# EAGLE design rapidshark-main-breakout-top-mk-1.1 (EAGLE 6.5.0)
AUTHOR: sean@yak.net
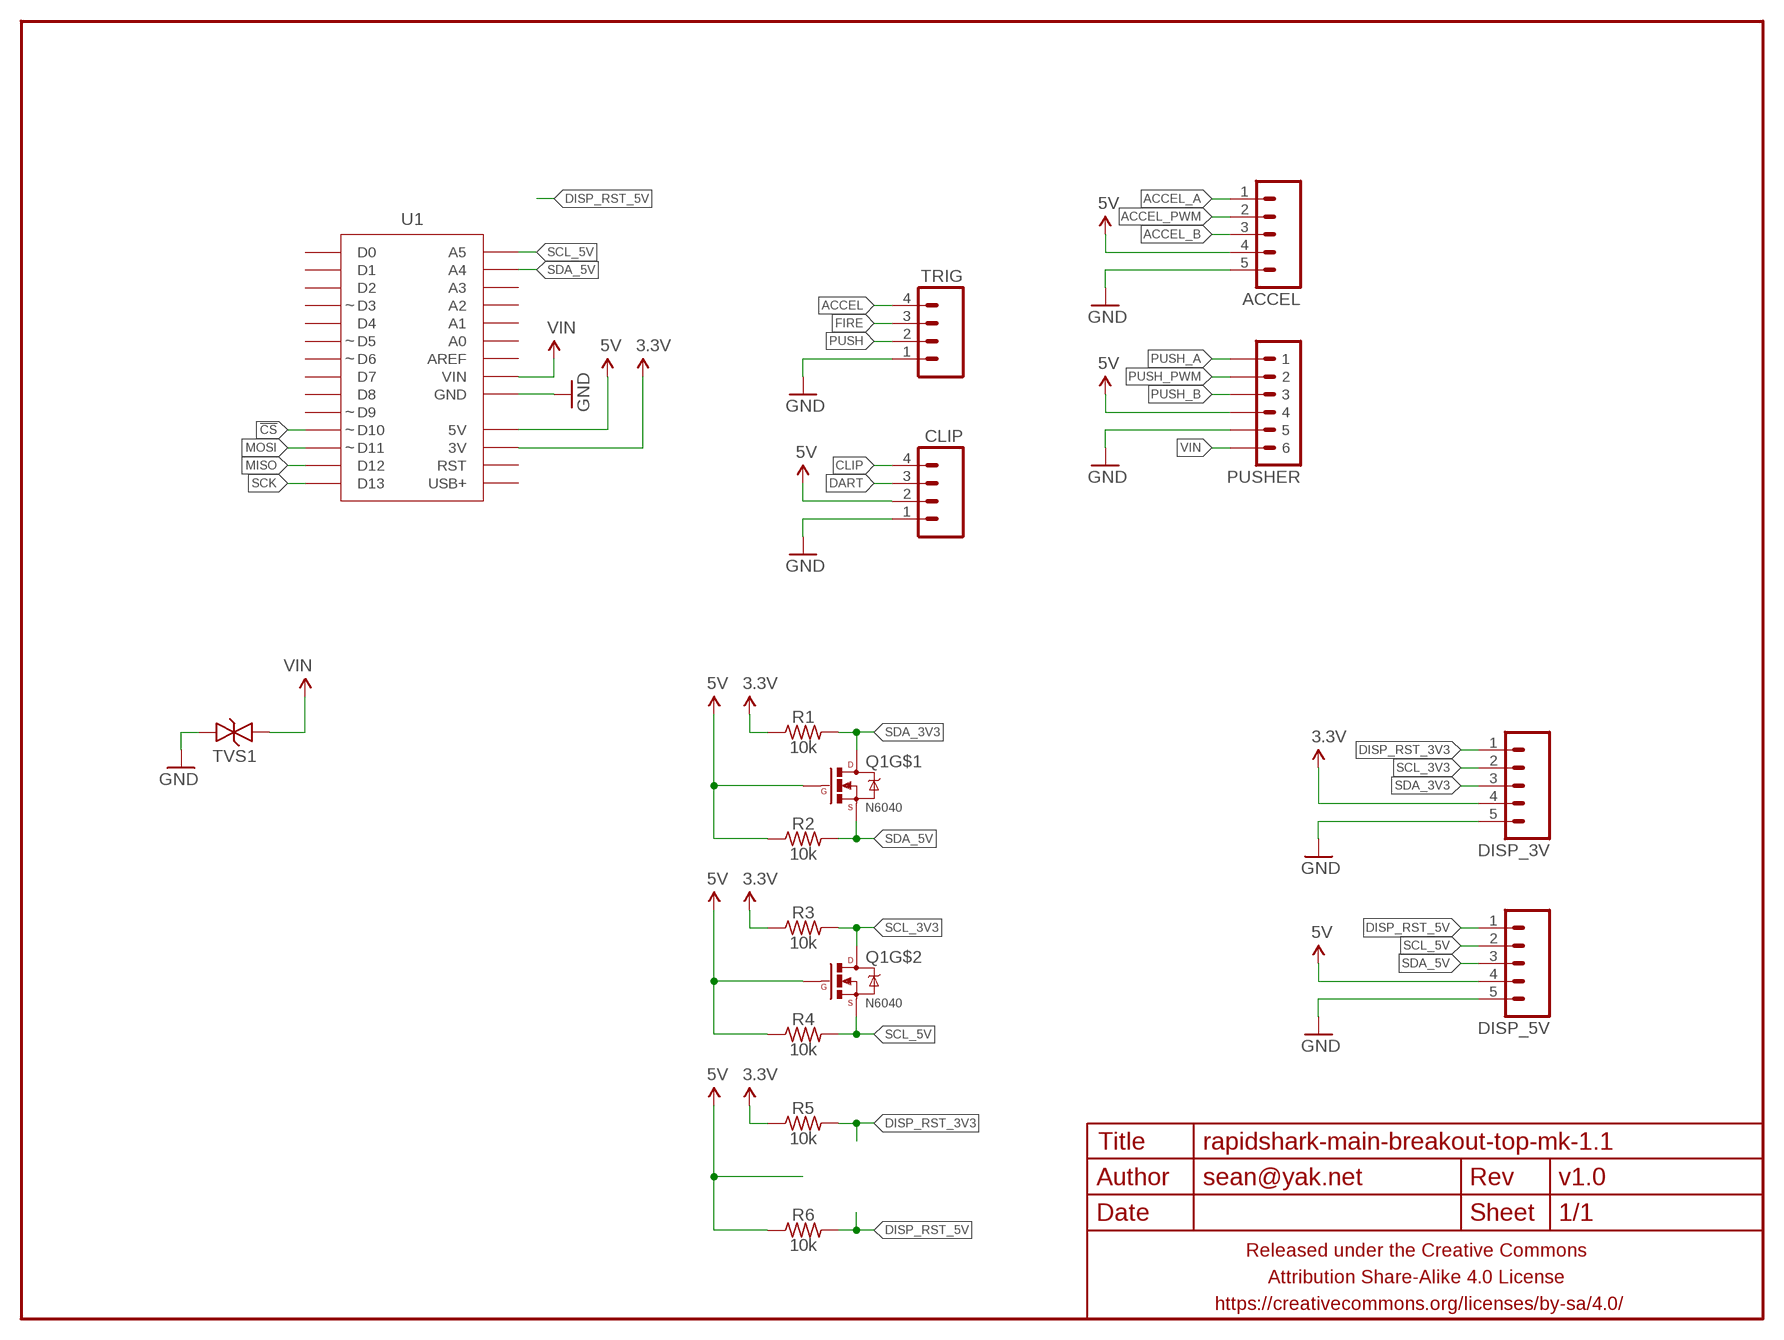
[diagram p0: schematic, sheet 1]

## Parts
ACCEL  M05JST-PH-VERT-PTH  [JST-5-PH-VERT-PTH]
CLIP  M04JST-PTH-VERT  [JST-4-PH-VERT-PTH]
DISP_3V  M05JST-PH-VERT-PTH  [JST-5-PH-VERT-PTH]
DISP_5V  M05JST-PH-VERT-PTH  [JST-5-PH-VERT-PTH]
FRAME1  FRAME-LETTERNO_PACKAGE  [DUMMY]
PUSHER  M06JST-PH-PTH-VERT  [JST-6-PH-VERT-PTH]
Q1  N6040  MOSFET-NCHANNEL-DUALSOIC8  [SO08]
R1  10k  RESISTORR0603  [R0603]
R2  10k  RESISTORR0603  [R0603]
R3  10k  RESISTORR0603  [R0603]
R4  10k  RESISTORR0603  [R0603]
R5  10k  RESISTORR0603  [R0603]
R6  10k  RESISTORR0603  [R0603]
TRIG  M04JST-PTH-VERT  [JST-4-PH-VERT-PTH]
TVS1  TVSSMA  [SMA-DIODE-TVS-BIDIR]
U1  ADAFRUIT_METRO_MININOSILK-ABMBI  [ADAFRUIT_METRO_MINI_FLIPPED]

## Nets
3.3V: DISP_3V.4 R1.1 R3.1 R5.1 U1.17(3V)
5V: ACCEL.4 CLIP.2 DISP_5V.4 Q1.2(G) Q1.4(G) R2.1 R4.1 R6.1 U1.18(5V)
!CS: U1.11(D10)
ACCEL: TRIG.4
ACCEL_A: ACCEL.1
ACCEL_B: ACCEL.3
ACCEL_PWM: ACCEL.2
CLIP: CLIP.4
DART: CLIP.3
DISP_RST_3V3: DISP_3V.1 R5.2
DISP_RST_5V: DISP_5V.1 R6.2
FIRE: TRIG.3
GND: ACCEL.5 CLIP.1 DISP_3V.5 DISP_5V.5 TRIG.1 TVS1.1 U1.19(GND) U1.20(GND)
MISO: U1.13(D12)
MOSI: U1.12(D11)
PUSH: TRIG.2
PUSH_A: PUSHER.1
PUSH_B: PUSHER.3
PUSH_PWM: PUSHER.2
SCK: U1.14(D13)
SCL_3V3: DISP_3V.2 Q1.5(D) Q1.6(D) R3.2
SCL_5V: DISP_5V.2 Q1.3(S) R4.2 U1.28(A5)
SDA_3V3: DISP_3V.3 Q1.7(D) Q1.8(D) R1.2
SDA_5V: DISP_5V.3 Q1.1(S) R2.2 U1.27(A4)
VIN: PUSHER.6 TVS1.2 U1.21(VIN)
Unconnected: PUSHER.4 PUSHER.5 U1.1(D0) U1.2(D1) U1.3(D2) U1.4(D3) U1.5(D4) U1.6(D5) U1.7(D6) U1.8(D7) U1.9(D8) U1.10(D9) U1.15(USB+) U1.16(RST) U1.22(AREF) U1.23(A0) U1.24(A1) U1.25(A2) U1.26(A3)

## Library data of the parts
ACCEL DISP_3V DISP_5V = A_butts:M05: Header 5 Standard 5-pin 0.1" header. Use with straight break away headers (SKU : PRT-00116), right angle break away headers (PRT-00553), swiss pins (PRT-00743), machine pins (PRT-00117), and female headers (PRT-00115). Molex polarized connector foot print use with SKU : PRT-08230 with associated crimp pins and housings.
CLIP TRIG = A_butts:M04: Header 4 Standard 4-pin 0.1" header. Use with straight break away headers (SKU : PRT-00116), right angle break away headers (PRT-00553), swiss pins (PRT-00743), machine pins (PRT-00117), and female headers (PRT-00115). Molex polarized connector foot print use with SKU : PRT-08231 with associated crimp pins and housings. 1MM SMD Version SKU: PRT-10208
FRAME1 = A_butts:FRAME-LETTER: Schematic Frame Standard 8.5x11 US Letter frame; DESIGNER: sean@yak.net; VERSION: v1.0
PUSHER = A_butts:M06: Header 6 Standard 6-pin 0.1" header. Use with straight break away headers (SKU : PRT-00116), right angle break away headers (PRT-00553), swiss pins (PRT-00743), machine pins (PRT-00117), and female headers (PRT-00115). Molex polarized connector foot print use with SKU : PRT-08094 with associated crimp pins and housings. NOTES ON THE VARIANTS LOCK and LOCK_LONGPADS... This footprint was designed to help hold the alignment of a through-hole component (i.e. 6-pin header) while soldering it into place. You may notice that each hole has been shifted either up or down by 0.005 of an inch from it's more standard position (which is a perfectly straight line). This slight alteration caused the pins (the squares in the middle) to touch the edges of the holes. Because they are alternating, it causes a "brace" to hold the component in place. 0.005 has proven to be the perfect amount of "off-center" position when using our standard breakaway headers. Although looks a little odd when you look at the bare footprint, once you have a header in there, the alteration is very hard to notice. Also,if you push a header all the way into place, it is covered up entirely on the bottom side. This idea of altering the position of holes to aid alignment will be further integrated into the Sparkfun Library for other footprints. It can help hold any component with 3 or more connection pins.
Q1 = A_butts:MOSFET-NCHANNEL-DUAL
R1-R6 = A_butts:RESISTOR: RESISTOR, American symbol
TVS1 = A_butts:TVS: Transient voltage suppressor- prevents ESD on inputs. Ignore package description- MBRA140 is NOT this type of part!!!
U1 = A_butts:ADAFRUIT_METRO_MINI

## Board
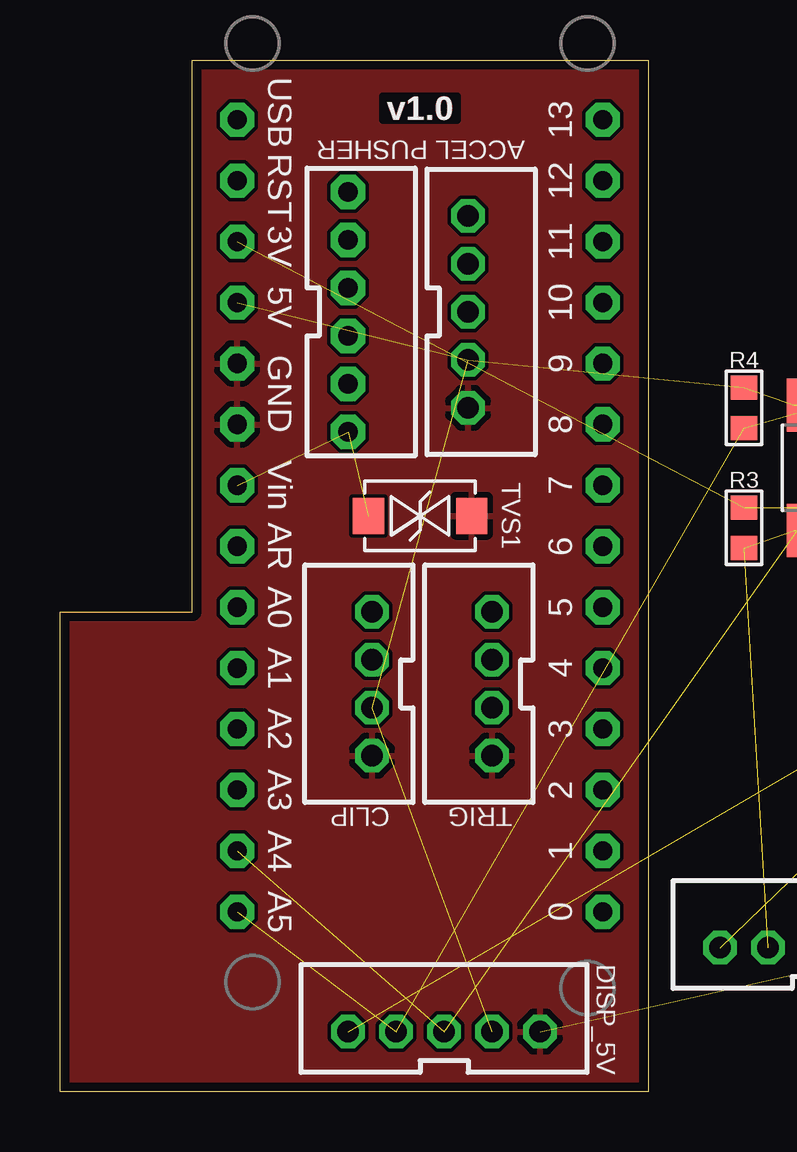
[diagram p1: board, top side]
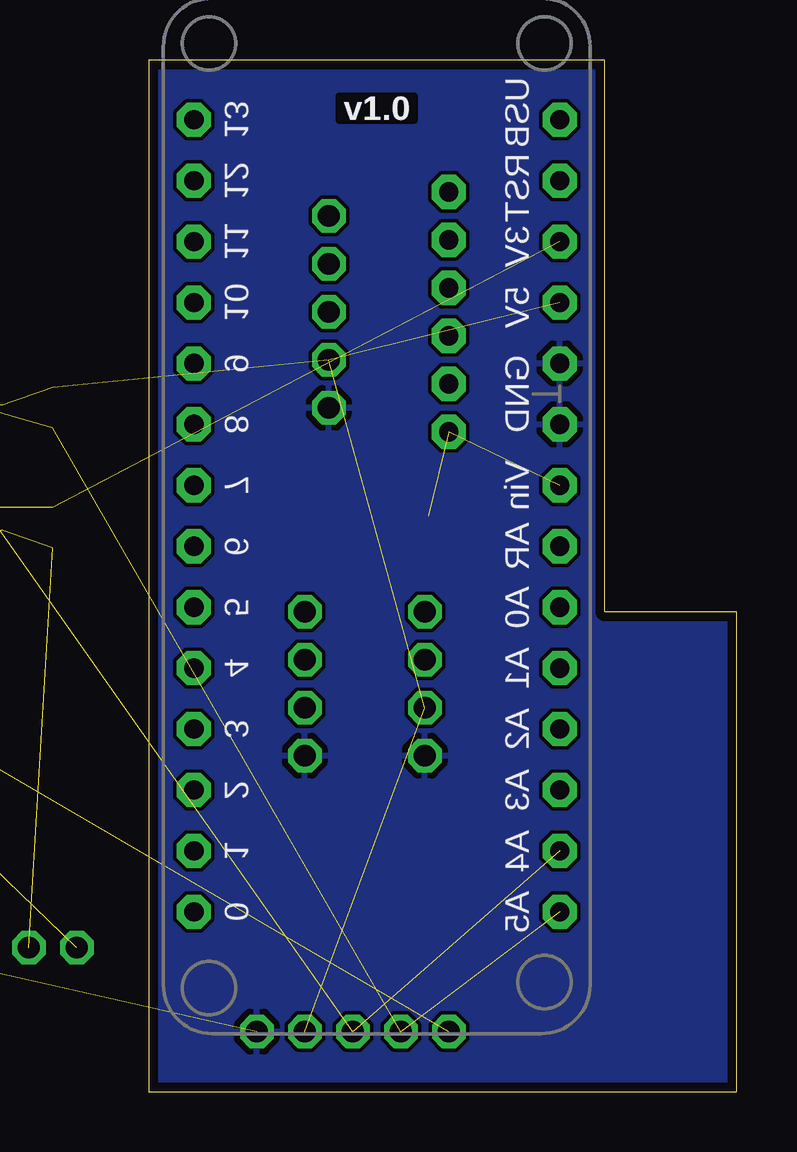
[diagram p2: board, bottom side, seen from below]

Size 24.5 x 43 mm. Coordinates in mm from the lower left corner, seen from the top.
Outline: 24.5,0 0,0 0,20 5.5,20 5.5,43 24.5,43 24.5,0
Copper layers (1*16): Top 0.0356mm / dielectric 1.5011mm / Bottom 0.0356mm
Design rules "LaenPCBOrder_2": minimum track width 6mil, minimum drill 13mil, track to track 6mil, track to pad 6mil, pad to pad 6mil, via to via 6mil, smd to smd 6mil, copper to edge 15mil, drill to drill 6mil, minimum pad ring 7mil, minimum via ring 7mil, stop-mask expansion 3mil, vias tented up to drill 20mil, thermal gap 10mil

### Footprints (pad centres in the part's own frame; a part is rotated, then mirrored left to right if it is on the bottom)
JST-5-PH-VERT-PTH = drill 0.9 pad 1.4 octagon: 1 -4,0; 2 -2,0; 3 0,0; 4 2,0; 5 4,0
JST-4-PH-VERT-PTH = drill 0.9 pad 1.4 octagon: 1 0,0; 2 2,0; 3 4,0; 4 6,0
JST-6-PH-VERT-PTH = drill 0.8 pad 1.422 octagon: 1 -5,0; 2 -3,0; 3 -1,0; 4 1,0; 5 3,0; 6 5,0
SO08 = smd 0.61 x 2.21: 1 -1.905,-2.616; 2 -0.635,-2.616; 3 0.635,-2.616; 4 1.905,-2.616; 5 1.905,2.616; 6 0.635,2.616; 7 -0.635,2.616; 8 -1.905,2.616
R0603 = smd 1 x 1.1: 1 -0.85,0; 2 0.85,0
SMA-DIODE-TVS-BIDIR = smd 1.3 x 1.5: 1 -2.15,0; 2 2.15,0
ADAFRUIT_METRO_MINI_FLIPPED = drill 0.8 pad 1.422 octagon: 1 16.51,7.62; 2 13.97,7.62; 3 11.43,7.62; 4 8.89,7.62; 5 6.35,7.62; 6 3.81,7.62; 7 1.27,7.62; 8 -1.27,7.62; 9 -3.81,7.62; 10 -6.35,7.62; 11 -8.89,7.62; 12 -11.43,7.62; 13 -13.97,7.62; 14 -16.51,7.62; 15 -16.51,-7.62; 16 -13.97,-7.62; 17 -11.43,-7.62; 18 -8.89,-7.62; 19 -6.35,-7.62; 20 -3.81,-7.62; 21 -1.27,-7.62; 22 1.27,-7.62; 23 3.81,-7.62; 24 6.35,-7.62; 25 8.89,-7.62; 26 11.43,-7.62; 27 13.97,-7.62; 28 16.51,-7.62

### Placement (x,y rotation side)
ACCEL  17,32.5 270 top
CLIP  13,14 90 top
DISP_3V  31.5,6 0 top
DISP_5V  16,2.5 0 top
FRAME1  0,0 0 bottom
PUSHER  12,32.5 270 top
Q1  32.5,26 180 top  (outside the outline)
R1  36.5,23.5 270 top  (outside the outline)
R2  36.5,28.5 270 top  (outside the outline)
R3  28.5,23.5 270 top  (outside the outline)
R4  28.5,28.5 270 top  (outside the outline)
R5  36,15 0 top  (outside the outline)
R6  36,17 0 top  (outside the outline)
TRIG  18,14 90 top
TVS1  15,24 180 top
U1  15,24 270 top

### Tracks (layer width: path | path; a pad name or v marks a point on that pad's centre or on a via)
3.3V  (4 unrouted)
5V  (8 unrouted)
DISP_RST_3V3  (1 unrouted)
DISP_RST_5V  (1 unrouted)
GND  (1 unrouted)
  pour Top (rank 6): 0,0 0,20 5.5,20 5.5,43 24.5,43 24.5,0
  pour Bottom (rank 6): 0,0 0,20 5.5,20 5.5,43 24.5,43 24.5,0
SCL_3V3  (3 unrouted)
SCL_5V  (3 unrouted)
SDA_3V3  (3 unrouted)
SDA_5V  (3 unrouted)
VIN  (2 unrouted)

### Text on the board
Top: TOP layer faces / LEFT of blaster
Bottom: BOTTOM layer faces / RIGHT of blaster
Reference: BARREL | DOWN | UP | BUTT
tDocu: TOP layer faces / LEFT of blaster
bDocu: BOTTOM layer faces / RIGHT of blaster